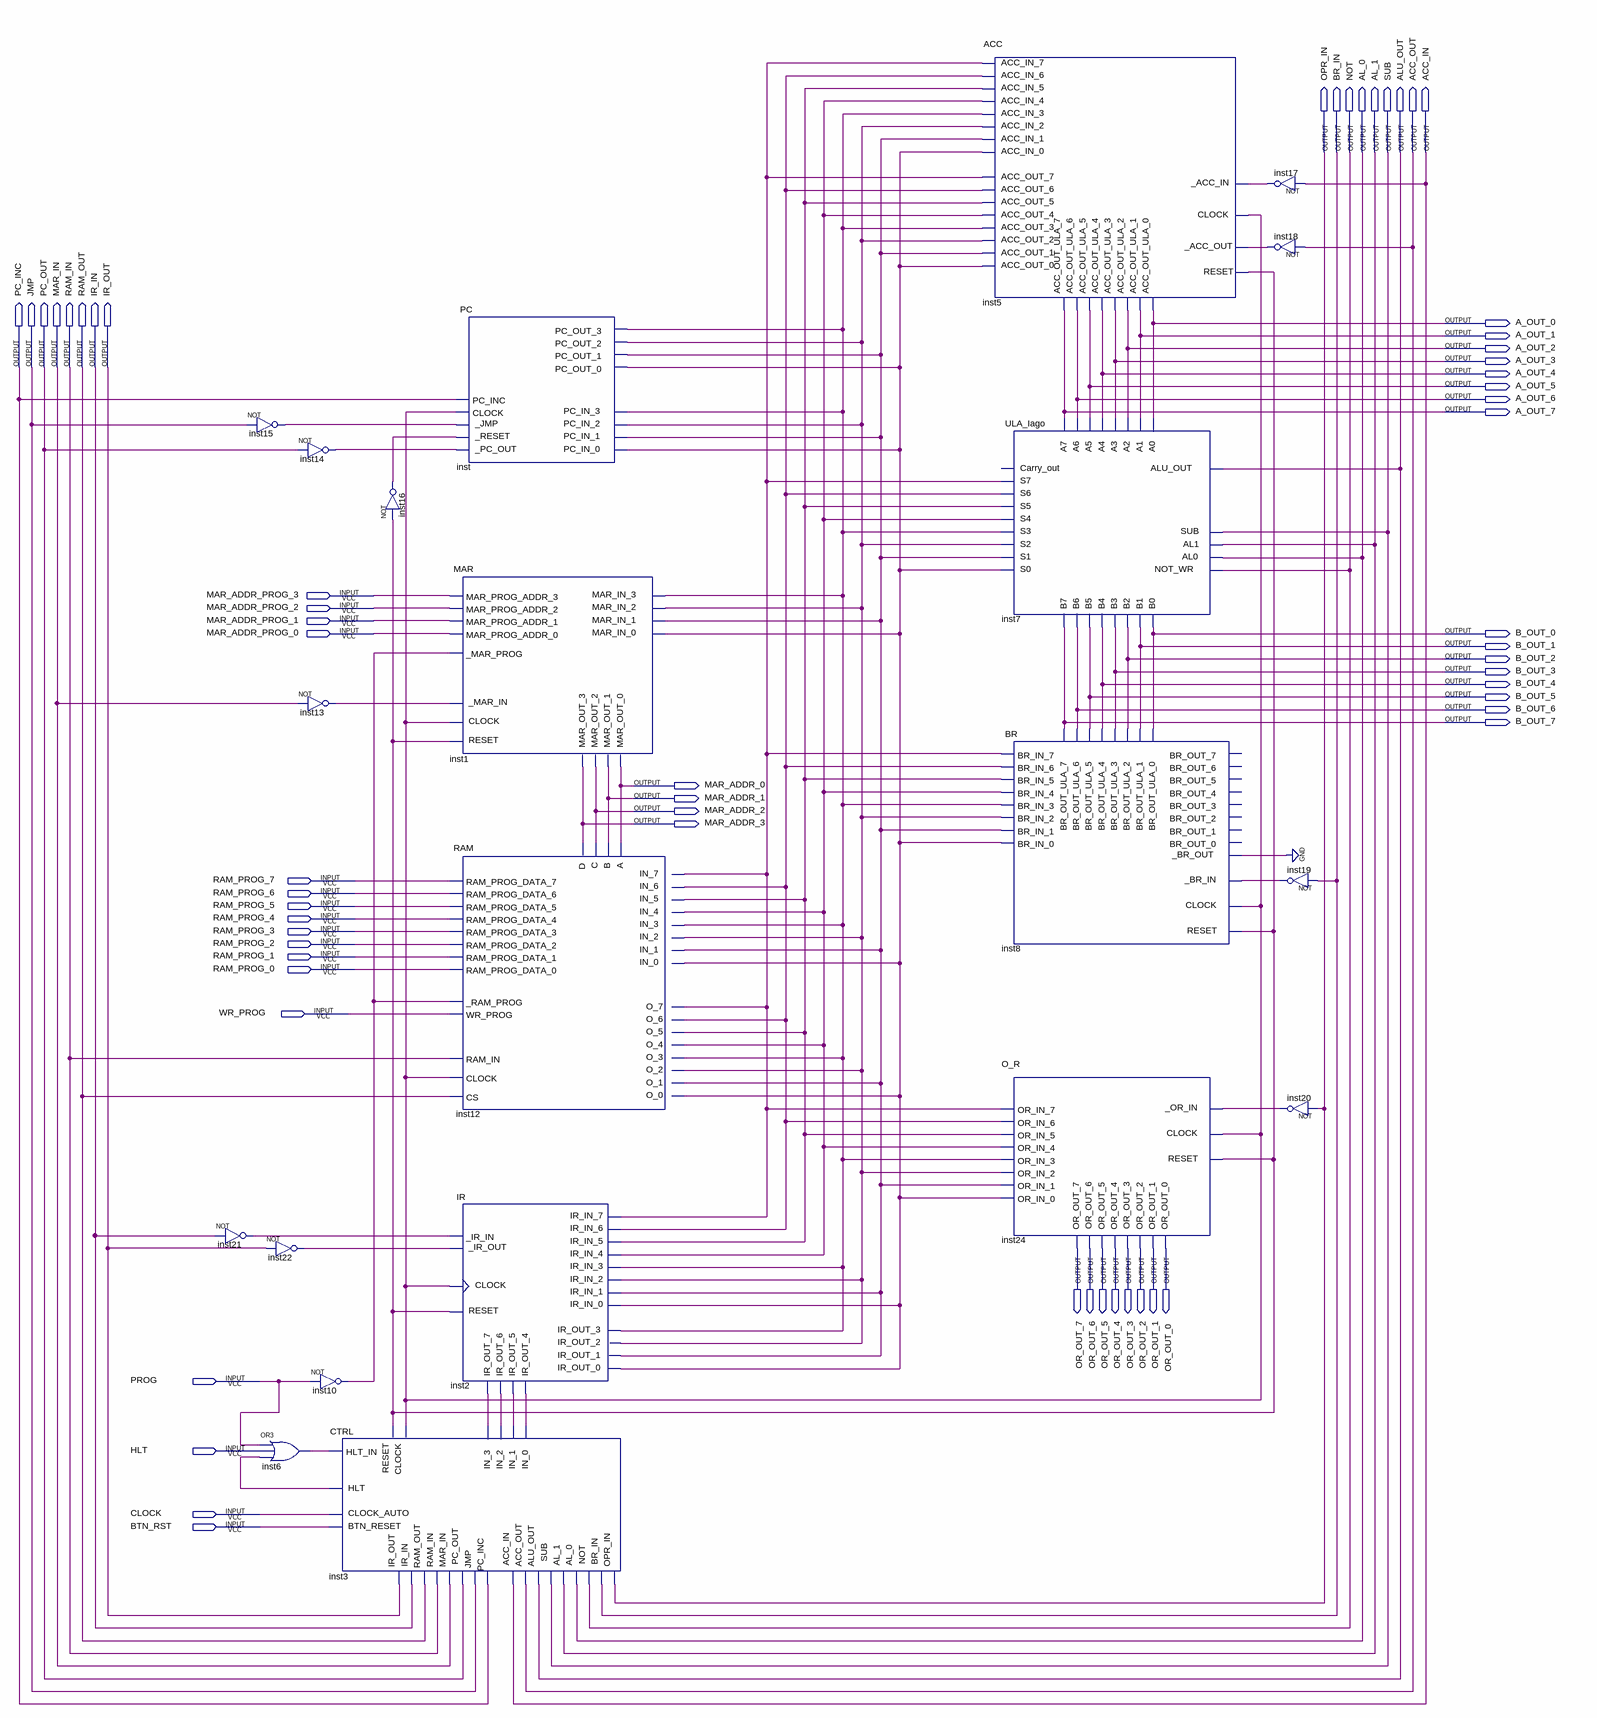
[diagram p0: schematic sheet]
// Quartus schematic SAP_BR.bdf as structural Verilog: 21 symbols, 62 pins
module SAP_BR (
  input  MAR_ADDR_PROG_3,
  input  MAR_ADDR_PROG_2,
  input  MAR_ADDR_PROG_1,
  input  MAR_ADDR_PROG_0,
  input  RAM_PROG_7,
  input  RAM_PROG_6,
  input  RAM_PROG_5,
  input  RAM_PROG_4,
  input  RAM_PROG_3,
  input  RAM_PROG_2,
  input  RAM_PROG_1,
  input  RAM_PROG_0,
  input  WR_PROG,
  input  PROG,
  input  HLT,
  input  CLOCK,
  input  BTN_RST,
  output OPR_IN,
  output BR_IN,
  output NOT,
  output AL_0,
  output AL_1,
  output SUB,
  output ALU_OUT,
  output ACC_OUT,
  output ACC_IN,
  output A_OUT_0,
  output A_OUT_1,
  output A_OUT_2,
  output A_OUT_3,
  output PC_INC,
  output JMP,
  output PC_OUT,
  output MAR_IN,
  output RAM_IN,
  output RAM_OUT,
  output IR_IN,
  output IR_OUT,
  output A_OUT_4,
  output A_OUT_5,
  output A_OUT_6,
  output A_OUT_7,
  output B_OUT_0,
  output B_OUT_1,
  output B_OUT_2,
  output B_OUT_3,
  output B_OUT_4,
  output B_OUT_5,
  output B_OUT_6,
  output B_OUT_7,
  output MAR_ADDR_0,
  output MAR_ADDR_1,
  output MAR_ADDR_2,
  output MAR_ADDR_3,
  output OR_OUT_7,
  output OR_OUT_6,
  output OR_OUT_5,
  output OR_OUT_4,
  output OR_OUT_3,
  output OR_OUT_2,
  output OR_OUT_1,
  output OR_OUT_0
);

  wire inst2_ir_out_4, inst2_ir_out_5, inst2_ir_out_6, inst2_ir_out_7, inst3_clock, inst3_hlt, inst3_reset,
       inst6_out, inst10_out, inst12_o_4, inst12_o_5, inst12_o_6, inst12_o_7, inst13_out, inst14_out,
       inst15_out, inst16_out, inst17_out, inst18_out, inst19_out, inst20_out, inst21_out, inst22_out,
       inst_pc_out_0, inst_pc_out_1, inst_pc_out_2, inst_pc_out_3;

  not inst21 (inst21_out, IR_IN);
  not inst15 (inst15_out, JMP);
  not inst22 (inst22_out, IR_OUT);
  or inst6 (inst6_out, PROG, HLT, inst3_hlt);
  not inst14 (inst14_out, PC_OUT);
  not inst13 (inst13_out, MAR_IN);
  not inst10 (inst10_out, PROG);
  CTRL inst3 (
    .BTN_RESET(BTN_RST), .CLOCK_AUTO(CLOCK), .HLT_IN(inst6_out), .IN_0(inst2_ir_out_4),
    .IN_1(inst2_ir_out_5), .IN_2(inst2_ir_out_6), .IN_3(inst2_ir_out_7), .RESET(inst3_reset),
    .HLT(inst3_hlt), .CLOCK(inst3_clock), .PC_INC(PC_INC), .JMP(JMP), .PC_OUT(PC_OUT), .MAR_IN(MAR_IN),
    .RAM_IN(RAM_IN), .RAM_OUT(RAM_OUT), .IR_IN(IR_IN), .IR_OUT(IR_OUT), .ACC_OUT(ACC_OUT), .ACC_IN(ACC_IN),
    .SUB(SUB), .AL_1(AL_1), .AL_0(AL_0), .ALU_OUT(ALU_OUT), .NOT(NOT), .BR_IN(BR_IN), .OPR_IN(OPR_IN));
  not inst16 (inst16_out, inst3_reset);
  PC inst (
    .PC_IN_0(inst_pc_out_0), .PC_IN_1(inst_pc_out_1), .PC_IN_2(inst_pc_out_2), .PC_IN_3(inst_pc_out_3),
    .PC_INC(PC_INC), .CLOCK(inst3_clock), ._PC_OUT(inst14_out), ._JMP(inst15_out), ._RESET(inst16_out),
    .PC_OUT_0(inst_pc_out_0), .PC_OUT_1(inst_pc_out_1), .PC_OUT_2(inst_pc_out_2), .PC_OUT_3(inst_pc_out_3));
  MAR inst1 (
    .MAR_PROG_ADDR_3(MAR_ADDR_PROG_3), .MAR_PROG_ADDR_2(MAR_ADDR_PROG_2), .MAR_PROG_ADDR_1(MAR_ADDR_PROG_1),
    .MAR_PROG_ADDR_0(MAR_ADDR_PROG_0), .MAR_IN_3(inst_pc_out_3), .MAR_IN_2(inst_pc_out_2),
    .MAR_IN_1(inst_pc_out_1), .MAR_IN_0(inst_pc_out_0), ._MAR_PROG(inst10_out), .CLOCK(inst3_clock),
    ._MAR_IN(inst13_out), .RESET(inst3_reset), .MAR_OUT_3(MAR_ADDR_3), .MAR_OUT_2(MAR_ADDR_2),
    .MAR_OUT_1(MAR_ADDR_1), .MAR_OUT_0(MAR_ADDR_0));
  RAM inst12 (
    ._RAM_PROG(inst10_out), .IN_7(inst12_o_7), .IN_6(inst12_o_6), .IN_5(inst12_o_5), .IN_4(inst12_o_4),
    .IN_3(inst_pc_out_3), .IN_2(inst_pc_out_2), .IN_1(inst_pc_out_1), .IN_0(inst_pc_out_0),
    .RAM_PROG_DATA_7(RAM_PROG_7), .RAM_PROG_DATA_6(RAM_PROG_6), .RAM_PROG_DATA_5(RAM_PROG_5),
    .RAM_PROG_DATA_4(RAM_PROG_4), .RAM_PROG_DATA_3(RAM_PROG_3), .RAM_PROG_DATA_2(RAM_PROG_2),
    .RAM_PROG_DATA_1(RAM_PROG_1), .RAM_PROG_DATA_0(RAM_PROG_0), .RAM_IN(RAM_IN), .CLOCK(inst3_clock),
    .WR_PROG(WR_PROG), .CS(RAM_OUT), .A(MAR_ADDR_0), .B(MAR_ADDR_1), .C(MAR_ADDR_2), .D(MAR_ADDR_3),
    .O_0(inst_pc_out_0), .O_1(inst_pc_out_1), .O_2(inst_pc_out_2), .O_3(inst_pc_out_3), .O_4(inst12_o_4),
    .O_5(inst12_o_5), .O_6(inst12_o_6), .O_7(inst12_o_7));
  IR inst2 (
    .IR_IN_7(inst12_o_7), .IR_IN_6(inst12_o_6), .IR_IN_5(inst12_o_5), .IR_IN_4(inst12_o_4),
    .CLOCK(inst3_clock), ._IR_IN(inst21_out), .RESET(inst3_reset), ._IR_OUT(inst22_out),
    .IR_IN_3(inst_pc_out_3), .IR_IN_2(inst_pc_out_2), .IR_IN_1(inst_pc_out_1), .IR_IN_0(inst_pc_out_0),
    .IR_OUT_7(inst2_ir_out_7), .IR_OUT_6(inst2_ir_out_6), .IR_OUT_5(inst2_ir_out_5),
    .IR_OUT_4(inst2_ir_out_4), .IR_OUT_3(inst_pc_out_3), .IR_OUT_2(inst_pc_out_2), .IR_OUT_1(inst_pc_out_1),
    .IR_OUT_0(inst_pc_out_0));
  ACC inst5 (
    .ACC_IN_7(inst12_o_7), .ACC_IN_6(inst12_o_6), .ACC_IN_5(inst12_o_5), .ACC_IN_4(inst12_o_4),
    .CLOCK(inst3_clock), ._ACC_IN(inst17_out), .RESET(inst3_reset), ._ACC_OUT(inst18_out),
    .ACC_IN_3(inst_pc_out_3), .ACC_IN_2(inst_pc_out_2), .ACC_IN_1(inst_pc_out_1), .ACC_IN_0(inst_pc_out_0),
    .ACC_OUT_7(inst12_o_7), .ACC_OUT_6(inst12_o_6), .ACC_OUT_5(inst12_o_5), .ACC_OUT_4(inst12_o_4),
    .ACC_OUT_3(inst_pc_out_3), .ACC_OUT_2(inst_pc_out_2), .ACC_OUT_1(inst_pc_out_1),
    .ACC_OUT_0(inst_pc_out_0), .ACC_OUT_ULA_7(A_OUT_7), .ACC_OUT_ULA_6(A_OUT_6), .ACC_OUT_ULA_4(A_OUT_4),
    .ACC_OUT_ULA_5(A_OUT_5), .ACC_OUT_ULA_3(A_OUT_3), .ACC_OUT_ULA_2(A_OUT_2), .ACC_OUT_ULA_1(A_OUT_1),
    .ACC_OUT_ULA_0(A_OUT_0));
  ULA_Iago inst7 (
    .AL0(AL_0), .AL1(AL_1), .NOT_WR(NOT), .ALU_OUT(ALU_OUT), .A7(A_OUT_7), .A6(A_OUT_6), .A5(A_OUT_5),
    .A4(A_OUT_4), .A3(A_OUT_3), .A2(A_OUT_2), .A1(A_OUT_1), .A0(A_OUT_0), .B7(B_OUT_7), .B6(B_OUT_6),
    .B5(B_OUT_5), .B4(B_OUT_4), .SUB(SUB), .B3(B_OUT_3), .B2(B_OUT_2), .B1(B_OUT_1), .B0(B_OUT_0),
    .S7(inst12_o_7), .S6(inst12_o_6), .S5(inst12_o_5), .S4(inst12_o_4), .S3(inst_pc_out_3),
    .S2(inst_pc_out_2), .S1(inst_pc_out_1), .S0(inst_pc_out_0));  // open: Carry_out
  BR inst8 (
    .BR_IN_7(inst12_o_7), .BR_IN_6(inst12_o_6), .BR_IN_5(inst12_o_5), .BR_IN_4(inst12_o_4),
    .CLOCK(inst3_clock), ._BR_IN(inst19_out), .RESET(inst3_reset), ._BR_OUT(1'b0), .BR_IN_3(inst_pc_out_3),
    .BR_IN_2(inst_pc_out_2), .BR_IN_1(inst_pc_out_1), .BR_IN_0(inst_pc_out_0), .BR_OUT_ULA_7(B_OUT_7),
    .BR_OUT_ULA_6(B_OUT_6), .BR_OUT_ULA_5(B_OUT_5), .BR_OUT_ULA_4(B_OUT_4), .BR_OUT_ULA_3(B_OUT_3),
    .BR_OUT_ULA_2(B_OUT_2), .BR_OUT_ULA_1(B_OUT_1), .BR_OUT_ULA_0(B_OUT_0));  // open: BR_OUT_7, BR_OUT_6, BR_OUT_5, BR_OUT_4, BR_OUT_3, BR_OUT_2, BR_OUT_1, BR_OUT_0
  O_R inst24 (
    .OR_IN_7(inst12_o_7), .OR_IN_6(inst12_o_6), .OR_IN_5(inst12_o_5), .OR_IN_4(inst12_o_4),
    .CLOCK(inst3_clock), ._OR_IN(inst20_out), .RESET(inst3_reset), .OR_IN_3(inst_pc_out_3),
    .OR_IN_2(inst_pc_out_2), .OR_IN_1(inst_pc_out_1), .OR_IN_0(inst_pc_out_0), .OR_OUT_7(OR_OUT_7),
    .OR_OUT_6(OR_OUT_6), .OR_OUT_5(OR_OUT_5), .OR_OUT_4(OR_OUT_4), .OR_OUT_3(OR_OUT_3), .OR_OUT_2(OR_OUT_2),
    .OR_OUT_1(OR_OUT_1), .OR_OUT_0(OR_OUT_0));
  not inst17 (inst17_out, ACC_IN);
  not inst18 (inst18_out, ACC_OUT);
  not inst19 (inst19_out, BR_IN);
  not inst20 (inst20_out, OPR_IN);
endmodule
